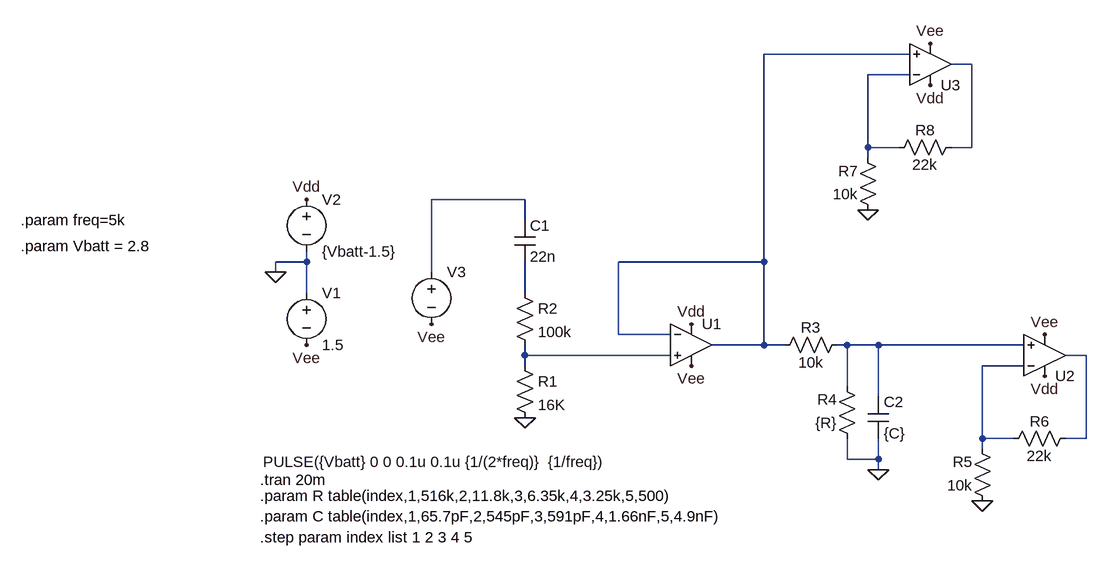
[diagram p0: schematic Simu_analog.asc]
Simu_analog.asc, the LTspice schematic file:
Version 4
SHEET 1 880 680
WIRE 512 -336 288 -336
WIRE 608 -320 576 -320
WIRE 512 -304 448 -304
WIRE 448 -192 448 -304
WIRE 496 -192 448 -192
WIRE 608 -192 608 -320
WIRE 608 -192 576 -192
WIRE 448 -176 448 -192
WIRE -80 -112 -224 -112
WIRE -80 -80 -80 -112
WIRE -416 -16 -416 -32
WIRE -416 -16 -464 -16
WIRE 288 -16 288 -336
WIRE 288 -16 64 -16
WIRE -464 0 -464 -16
WIRE -224 0 -224 -112
WIRE -416 32 -416 -16
WIRE -80 32 -80 -16
WIRE 64 96 64 -16
WIRE 144 96 64 96
WIRE 288 112 288 -16
WIRE 288 112 208 112
WIRE 320 112 288 112
WIRE 416 112 400 112
WIRE 464 112 416 112
WIRE 688 112 464 112
WIRE -80 128 -80 112
WIRE 144 128 -80 128
WIRE 784 128 752 128
WIRE -80 144 -80 128
WIRE 688 144 624 144
WIRE 416 176 416 112
WIRE 464 192 464 112
WIRE 624 256 624 144
WIRE 672 256 624 256
WIRE 784 256 784 128
WIRE 784 256 752 256
WIRE 624 272 624 256
WIRE 416 288 416 256
WIRE 464 288 464 256
WIRE 464 288 416 288
WIRE 464 304 464 288
FLAG -464 0 0
FLAG -416 112 Vee
FLAG 176 144 Vee
FLAG 176 80 Vdd
FLAG -416 -112 Vdd
FLAG -224 80 Vee
FLAG 464 304 0
FLAG -80 224 0
FLAG 624 352 0
FLAG 448 -96 0
FLAG 544 -352 Vee
FLAG 720 96 Vee
FLAG 720 160 Vdd
FLAG 544 -288 Vdd
SYMBOL Opamps\\UniversalOpamp2 176 112 R0
SYMATTR InstName U1
SYMBOL Opamps\\UniversalOpamp2 720 128 M180
SYMATTR InstName U2
SYMBOL voltage -416 16 R0
WINDOW 123 0 0 Left 2
WINDOW 39 0 0 Left 2
SYMATTR InstName V1
SYMATTR Value 1.5
SYMBOL voltage -416 -128 R0
WINDOW 123 0 0 Left 2
WINDOW 39 0 0 Left 2
SYMATTR InstName V2
SYMATTR Value {Vbatt-1.5}
SYMBOL res -96 128 R0
SYMATTR InstName R1
SYMATTR Value 16K
SYMBOL res -96 16 R0
SYMATTR InstName R2
SYMATTR Value 100k
SYMBOL cap -96 -80 R0
SYMATTR InstName C1
SYMATTR Value 22n
SYMBOL voltage -224 -16 R0
WINDOW 3 -259 308 Left 2
WINDOW 123 0 0 Left 2
WINDOW 39 0 0 Left 2
SYMATTR Value PULSE({Vbatt} 0 0 0.1u 0.1u {1/(2*freq)}  {1/freq})
SYMATTR InstName V3
SYMBOL res 416 96 R90
WINDOW 0 5 56 VBottom 2
WINDOW 3 27 56 VTop 2
SYMATTR InstName R3
SYMATTR Value 10k
SYMBOL res 432 272 R180
WINDOW 0 31 76 Left 2
WINDOW 3 31 40 Left 2
SYMATTR InstName R4
SYMATTR Value {R}
SYMBOL cap 448 192 R0
SYMATTR InstName C2
SYMATTR Value {C}
SYMBOL res 640 368 R180
WINDOW 0 31 76 Left 2
WINDOW 3 31 40 Left 2
SYMATTR InstName R5
SYMATTR Value 10k
SYMBOL res 768 240 R90
WINDOW 0 5 56 VBottom 2
WINDOW 3 27 56 VTop 2
SYMATTR InstName R6
SYMATTR Value 22k
SYMBOL Opamps\\UniversalOpamp2 544 -320 M180
SYMATTR InstName U3
SYMBOL res 464 -80 R180
WINDOW 0 31 76 Left 2
WINDOW 3 31 40 Left 2
SYMATTR InstName R7
SYMATTR Value 10k
SYMBOL res 592 -208 R90
WINDOW 0 5 56 VBottom 2
WINDOW 3 27 56 VTop 2
SYMATTR InstName R8
SYMATTR Value 22k
TEXT -488 320 Left 2 !.tran 20m
TEXT -856 -80 Left 2 !.param freq=5k
TEXT -856 -40 Left 2 !.param Vbatt = 2.8
TEXT -488 344 Left 2 !.param R table(index,1,516k,2,11.8k,3,6.35k,4,3.25k,5,500)
TEXT -488 376 Left 2 !.param C table(index,1,65.7pF,2,545pF,3,591pF,4,1.66nF,5,4.9nF)
TEXT -488 408 Left 2 !.step param index list 1 2 3 4 5

The netlist it stands for:
* Simu_analog.asc
XU1 N007 N001 Vdd Vee N001 level.2 Avol=1Meg GBW=10Meg Slew=10Meg ilimit=25m rail=0 Vos=0 phimargin=45 en=0 enk=0 in=0 ink=0 Rin=500Meg  ; pins IN+ IN- V+ V- OUT
XU2 N006 N009 Vdd Vee N008 level.2 Avol=1Meg GBW=10Meg Slew=10Meg ilimit=25m rail=0 Vos=0 phimargin=45 en=0 enk=0 in=0 ink=0 Rin=500Meg  ; pins IN+ IN- V+ V- OUT
V1 0 Vee 1.5
V2 Vdd 0 {Vbatt-1.5}
R1 N007 0 16K
R2 N005 N007 100k
C1 N004 N005 22n
V3 N004 Vee PULSE({Vbatt} 0 0 0.1u 0.1u {1/(2*freq)}  {1/freq})
R3 N006 N001 10k
R4 0 N006 {R}
C2 N006 0 {C}
R5 0 N009 10k
R6 N008 N009 22k
XU3 N001 N003 Vdd Vee N002 level.2 Avol=1Meg GBW=10Meg Slew=10Meg ilimit=25m rail=0 Vos=0 phimargin=45 en=0 enk=0 in=0 ink=0 Rin=500Meg  ; pins IN+ IN- V+ V- OUT
R7 0 N003 10k
R8 N002 N003 22k
.tran 20m
.param freq=5k
.param Vbatt = 2.8
.param R table(index,1,516k,2,11.8k,3,6.35k,4,3.25k,5,500)
.param C table(index,1,65.7pF,2,545pF,3,591pF,4,1.66nF,5,4.9nF)
.step param index list 1 2 3 4 5
.lib UniversalOpamps2.sub
.backanno
.end